# Altium schematic sheet digi_5V.SchDoc
size A4
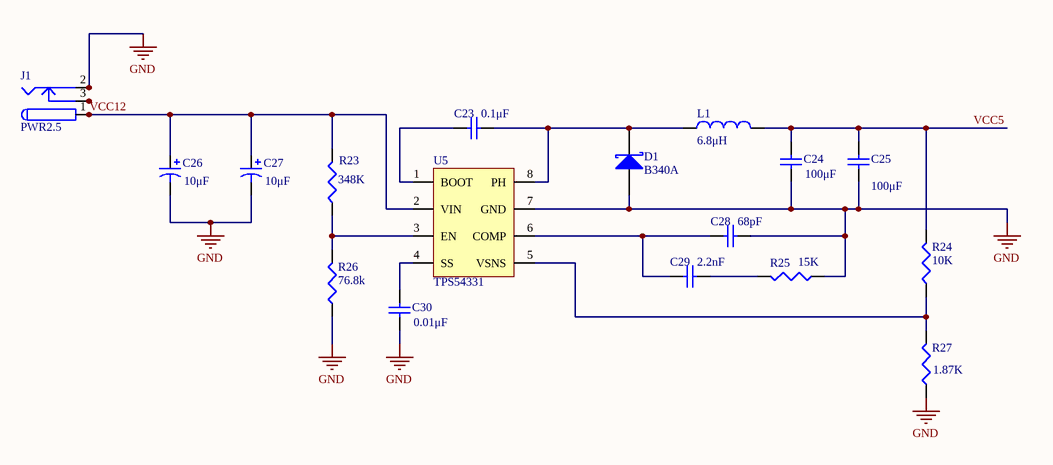
[diagram p0: digi_5V.SchDoc]

## Parts
C23  value 0.1μF  [1608[0603]]  (hidden comment: Cap Semi)
C24  value 100μF  [1608[0603]]  (hidden comment: Cap Semi)
C25  value 100μF  [1608[0603]]  (hidden comment: Cap Semi)
C26  value 10μF  [C0805]  (hidden comment: Cap Pol3)
C27  value 10μF  [C0805]  (hidden comment: Cap Pol3)
C28  value 68pF  [1608[0603]]  (hidden comment: Cap Semi)
C29  value 2.2nF  [1608[0603]]  (hidden comment: Cap Semi)
C30  value 0.01μF  [1608[0603]]  (hidden comment: Cap Semi)
D1  B340A  [LED0603]
J1  PWR2.5  [KLD-0202]
L1  value 6.8μH  [LC Inductor 127]  (hidden comment: Inductor)
R23  value 348K  [J1-0603]  (hidden comment: Res3)
R24  value 10K  [J1-0603]  (hidden comment: Res3)
R25  value 15K  [J1-0603]  (hidden comment: Res3)
R26  value 76.8k  [J1-0603]  (hidden comment: Res3)
R27  value 1.87K  [J1-0603]  (hidden comment: Res3)
U5  TPS54331  [SOIC127P600X175-8N]

## Nets
GND: C24.1 C25.1 C26.2 C27.2 C28.1 C30.1 D1.1(A) J1.2 J1.2A J1.2B R25.1 R26.1 R27.1 U5.7(GND)
VCC5: C24.2 C25.2 L1.2 R24.2
VCC12: C26.1 C27.1 J1.1 J1.1A J1.1B R23.2 U5.2(VIN)
NetC23_1: C23.1 U5.1(BOOT)
NetC23_2: C23.2 D1.2(K) L1.1 U5.8(PH)
NetC28_2: C28.2 C29.1 U5.6(COMP)
NetC29_2: C29.2 R25.2
NetC30_2: C30.2 U5.4(SS)
NetJ1_3: J1.3 J1.3A J1.3B
NetR23_1: R23.1 R26.2 U5.3(EN)
NetR24_1: R24.1 R27.2 U5.5(VSNS)

## Library data of the parts
C23-C25 C28-C30 = Cap Semi: Capacitor (Semiconductor SIM Model); Published: 8-Jun-2000; LatestRevisionDate: 29-May-2009; LatestRevisionNote: IPC-7351 Footprint Added.; PackageReference: C1206; Publisher: Altium Limited; PackageDescription: Chip Capacitor
C26 C27 = Cap Pol3: Polarized Capacitor (Surface Mount); Published: 8-Jun-2000; LatestRevisionDate: 29-May-2009; LatestRevisionNote: IPC-7351 Footprint Added.; PackageReference: C0805; Publisher: Altium Limited; PackageDescription: Chip Capacitor
D1 = D Schottky: Schottky Diode; Published: 8-Jun-2000; LatestRevisionDate: 17-Jul-2002; LatestRevisionNote: Re-released for DXP Platform.; PackageReference: SMB; Publisher: Altium Limited; PackageDescription: DO-214-AA/SMB; 2 C-Bend Leads; Body 5.3 x 3.6 mm, inc. leads (LxW); Code_JEDEC: DO-214-AA
J1 = PWR2.5: Low Voltage Power Supply Connector; Published: 17-Dec-2003; DatasheetDocument: 09-May-2002; Publisher: Altium Limited; ComponentLink1Description: Manufacturer Link; ComponentLink1URL: http://domino.kycon.com/internet/Products.html
L1 = Inductor: Code_IEC: 1005; Published: 8-Jun-2000; LatestRevisionDate: 29-May-2009; LatestRevisionNote: IPC-7351 Footprint Added.; PackageReference: 0402-A; Publisher: Altium Limited; PackageDescription: Chip Inductor; Code_JEITA: 0402
R23-R27 = Res3: Resistor; Published: 8-Jun-2000; LatestRevisionDate: 29-May-2009; LatestRevisionNote: IPC-7351 Footprint Added.; PackageReference: J1-0603; Publisher: Altium Limited; PackageDescription: Chip Resistor